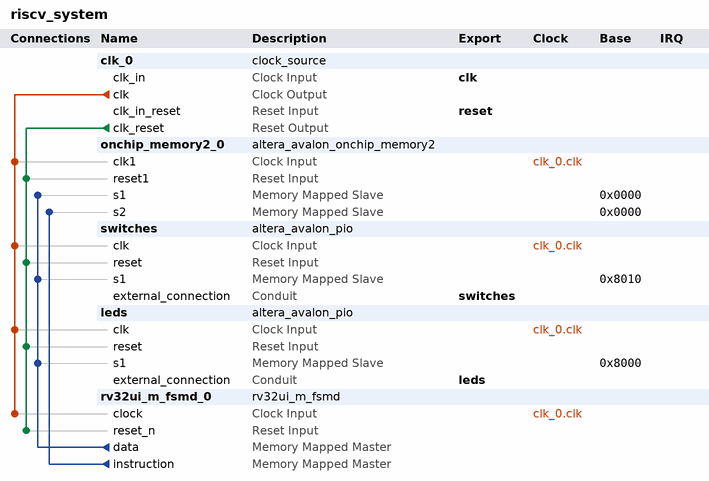
[diagram p0: system contents]
# Platform Designer (Qsys) system riscv_system, Cyclone V 5CSEMA5F31C6
# Parameters at their usual value, and those the tool derives, are not listed.
package require -exact qsys 18.1
create_system riscv_system
set_project_property DEVICE_FAMILY {Cyclone V}
set_project_property DEVICE 5CSEMA5F31C6

add_instance clk_0 clock_source 18.1
set_instance_parameter_value clk_0 clockFrequency 50000000

add_instance onchip_memory2_0 altera_avalon_onchip_memory2 18.1
set_instance_parameter_value onchip_memory2_0 dataWidth 32
set_instance_parameter_value onchip_memory2_0 dualPort true
set_instance_parameter_value onchip_memory2_0 initMemContent true
set_instance_parameter_value onchip_memory2_0 initializationFileName X:/test/c/checkSystem2.hex
set_instance_parameter_value onchip_memory2_0 memorySize 32768
set_instance_parameter_value onchip_memory2_0 readDuringWriteMode OLD_DATA
set_instance_parameter_value onchip_memory2_0 singleClockOperation true
set_instance_parameter_value onchip_memory2_0 useNonDefaultInitFile true

add_instance switches altera_avalon_pio 18.1
set_instance_parameter_value switches direction Input
set_instance_parameter_value switches width 8

add_instance leds altera_avalon_pio 18.1
set_instance_parameter_value leds direction Output
set_instance_parameter_value leds width 8

add_instance rv32ui_m_fsmd_0 rv32ui_m_fsmd 1.0

# connections
add_connection clk_0.clk leds.clk clock
add_connection clk_0.clk onchip_memory2_0.clk1 clock
add_connection clk_0.clk rv32ui_m_fsmd_0.clock clock
add_connection clk_0.clk switches.clk clock
add_connection clk_0.clk_reset leds.reset reset
add_connection clk_0.clk_reset onchip_memory2_0.reset1 reset
add_connection clk_0.clk_reset rv32ui_m_fsmd_0.reset_n reset
add_connection clk_0.clk_reset switches.reset reset
add_connection rv32ui_m_fsmd_0.data leds.s1 avalon
set_connection_parameter_value rv32ui_m_fsmd_0.data/leds.s1 baseAddress 0x8000
add_connection rv32ui_m_fsmd_0.data onchip_memory2_0.s1 avalon
set_connection_parameter_value rv32ui_m_fsmd_0.data/onchip_memory2_0.s1 baseAddress 0x0000
add_connection rv32ui_m_fsmd_0.data switches.s1 avalon
set_connection_parameter_value rv32ui_m_fsmd_0.data/switches.s1 baseAddress 0x8010
add_connection rv32ui_m_fsmd_0.instruction onchip_memory2_0.s2 avalon
set_connection_parameter_value rv32ui_m_fsmd_0.instruction/onchip_memory2_0.s2 baseAddress 0x0000

# exported interfaces
add_interface clk clock sink
set_interface_property clk EXPORT_OF clk_0.clk_in
add_interface leds conduit end
set_interface_property leds EXPORT_OF leds.external_connection
add_interface reset reset sink
set_interface_property reset EXPORT_OF clk_0.clk_in_reset
add_interface switches conduit end
set_interface_property switches EXPORT_OF switches.external_connection

set_interconnect_requirement {$system} qsys_mm.clockCrossingAdapter HANDSHAKE
set_interconnect_requirement {$system} qsys_mm.enableEccProtection FALSE
set_interconnect_requirement {$system} qsys_mm.insertDefaultSlave FALSE
set_interconnect_requirement {$system} qsys_mm.maxAdditionalLatency 1

save_system riscv_system.qsys
